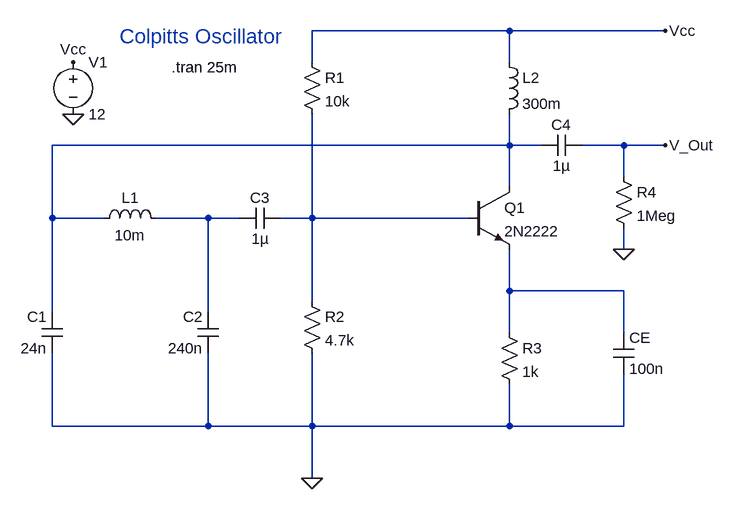
[diagram p0: schematic Colpitts.asc]
Colpitts.asc, the LTspice schematic file:
Version 4.1
SHEET 1 880 680
WIRE 432 -224 128 -224
WIRE 672 -224 432 -224
WIRE 128 -176 128 -224
WIRE 432 -176 432 -224
WIRE 432 -48 432 -96
WIRE 432 -48 -272 -48
WIRE 480 -48 432 -48
WIRE 608 -48 544 -48
WIRE 672 -48 608 -48
WIRE 608 0 608 -48
WIRE 432 16 432 -48
WIRE -272 64 -272 -48
WIRE -192 64 -272 64
WIRE -32 64 -112 64
WIRE 16 64 -32 64
WIRE 128 64 128 -96
WIRE 128 64 80 64
WIRE 368 64 128 64
WIRE 608 112 608 80
WIRE 432 176 432 112
WIRE 608 176 432 176
WIRE 128 192 128 64
WIRE -272 208 -272 64
WIRE -32 208 -32 64
WIRE 432 240 432 176
WIRE 608 240 608 176
WIRE -272 384 -272 272
WIRE -32 384 -32 272
WIRE -32 384 -272 384
WIRE 128 384 128 272
WIRE 128 384 -32 384
WIRE 432 384 432 320
WIRE 432 384 128 384
WIRE 608 384 608 304
WIRE 608 384 432 384
WIRE 128 464 128 384
FLAG 128 464 0
FLAG -240 -96 0
FLAG -240 -176 Vcc
FLAG 672 -224 Vcc
FLAG 672 -48 V_Out
FLAG 608 112 0
SYMBOL npn 368 16 R0
SYMATTR InstName Q1
SYMATTR Value 2N2222
SYMBOL voltage -240 -192 R0
WINDOW 123 0 0 Left 0
WINDOW 39 0 0 Left 0
SYMATTR InstName V1
SYMATTR Value 12
SYMBOL cap -256 272 R180
WINDOW 0 24 56 Left 2
WINDOW 3 24 8 Left 2
SYMATTR InstName C1
SYMATTR Value 24n
SYMBOL cap -16 272 R180
WINDOW 0 24 56 Left 2
WINDOW 3 24 8 Left 2
SYMATTR InstName C2
SYMATTR Value 240n
SYMBOL cap 16 80 R270
WINDOW 0 32 32 VTop 2
WINDOW 3 0 32 VBottom 2
SYMATTR InstName C3
SYMATTR Value 1µ
SYMBOL cap 480 -32 R270
WINDOW 0 32 32 VTop 2
WINDOW 3 0 32 VBottom 2
SYMATTR InstName C4
SYMATTR Value 1µ
SYMBOL cap 592 240 R0
SYMATTR InstName CE
SYMATTR Value 100n
SYMBOL res 112 -192 R0
SYMATTR InstName R1
SYMATTR Value 10k
SYMBOL res 112 176 R0
SYMATTR InstName R2
SYMATTR Value 4.7k
SYMBOL res 416 224 R0
SYMATTR InstName R3
SYMATTR Value 1k
SYMBOL ind -208 80 R270
WINDOW 0 32 56 VTop 2
WINDOW 3 5 56 VBottom 2
SYMATTR InstName L1
SYMATTR Value 10m
SYMATTR SpiceLine Rser=1m
SYMBOL ind 416 -192 R0
SYMATTR InstName L2
SYMATTR Value 300m
SYMATTR SpiceLine Rser=1m
SYMBOL res 592 -16 R0
SYMATTR InstName R4
SYMATTR Value 1Meg
TEXT -168 -216 Left 3 ;Colpitts Oscillator
TEXT -88 -168 Left 2 !.tran 25m

The netlist it stands for:
* Colpitts.asc
Q1 N001 N003 N004 0 2N2222
V1 Vcc 0 12
C1 0 N001 24n
C2 0 N002 240n
C3 N002 N003 1µ
C4 N001 V_Out 1µ
CE N004 0 100n
R1 Vcc N003 10k
R2 N003 0 4.7k
R3 N004 0 1k
L1 N001 N002 10m Rser=1m
L2 Vcc N001 300m Rser=1m
R4 V_Out 0 1Meg
.model NPN NPN
.model PNP PNP
.lib standard.bjt
* Colpitts Oscillator
.tran 25m
.backanno
.end